# EAGLE schematic 20170814_DukeExperimentalHeadstageAmplifier (EAGLE 8.2.2)
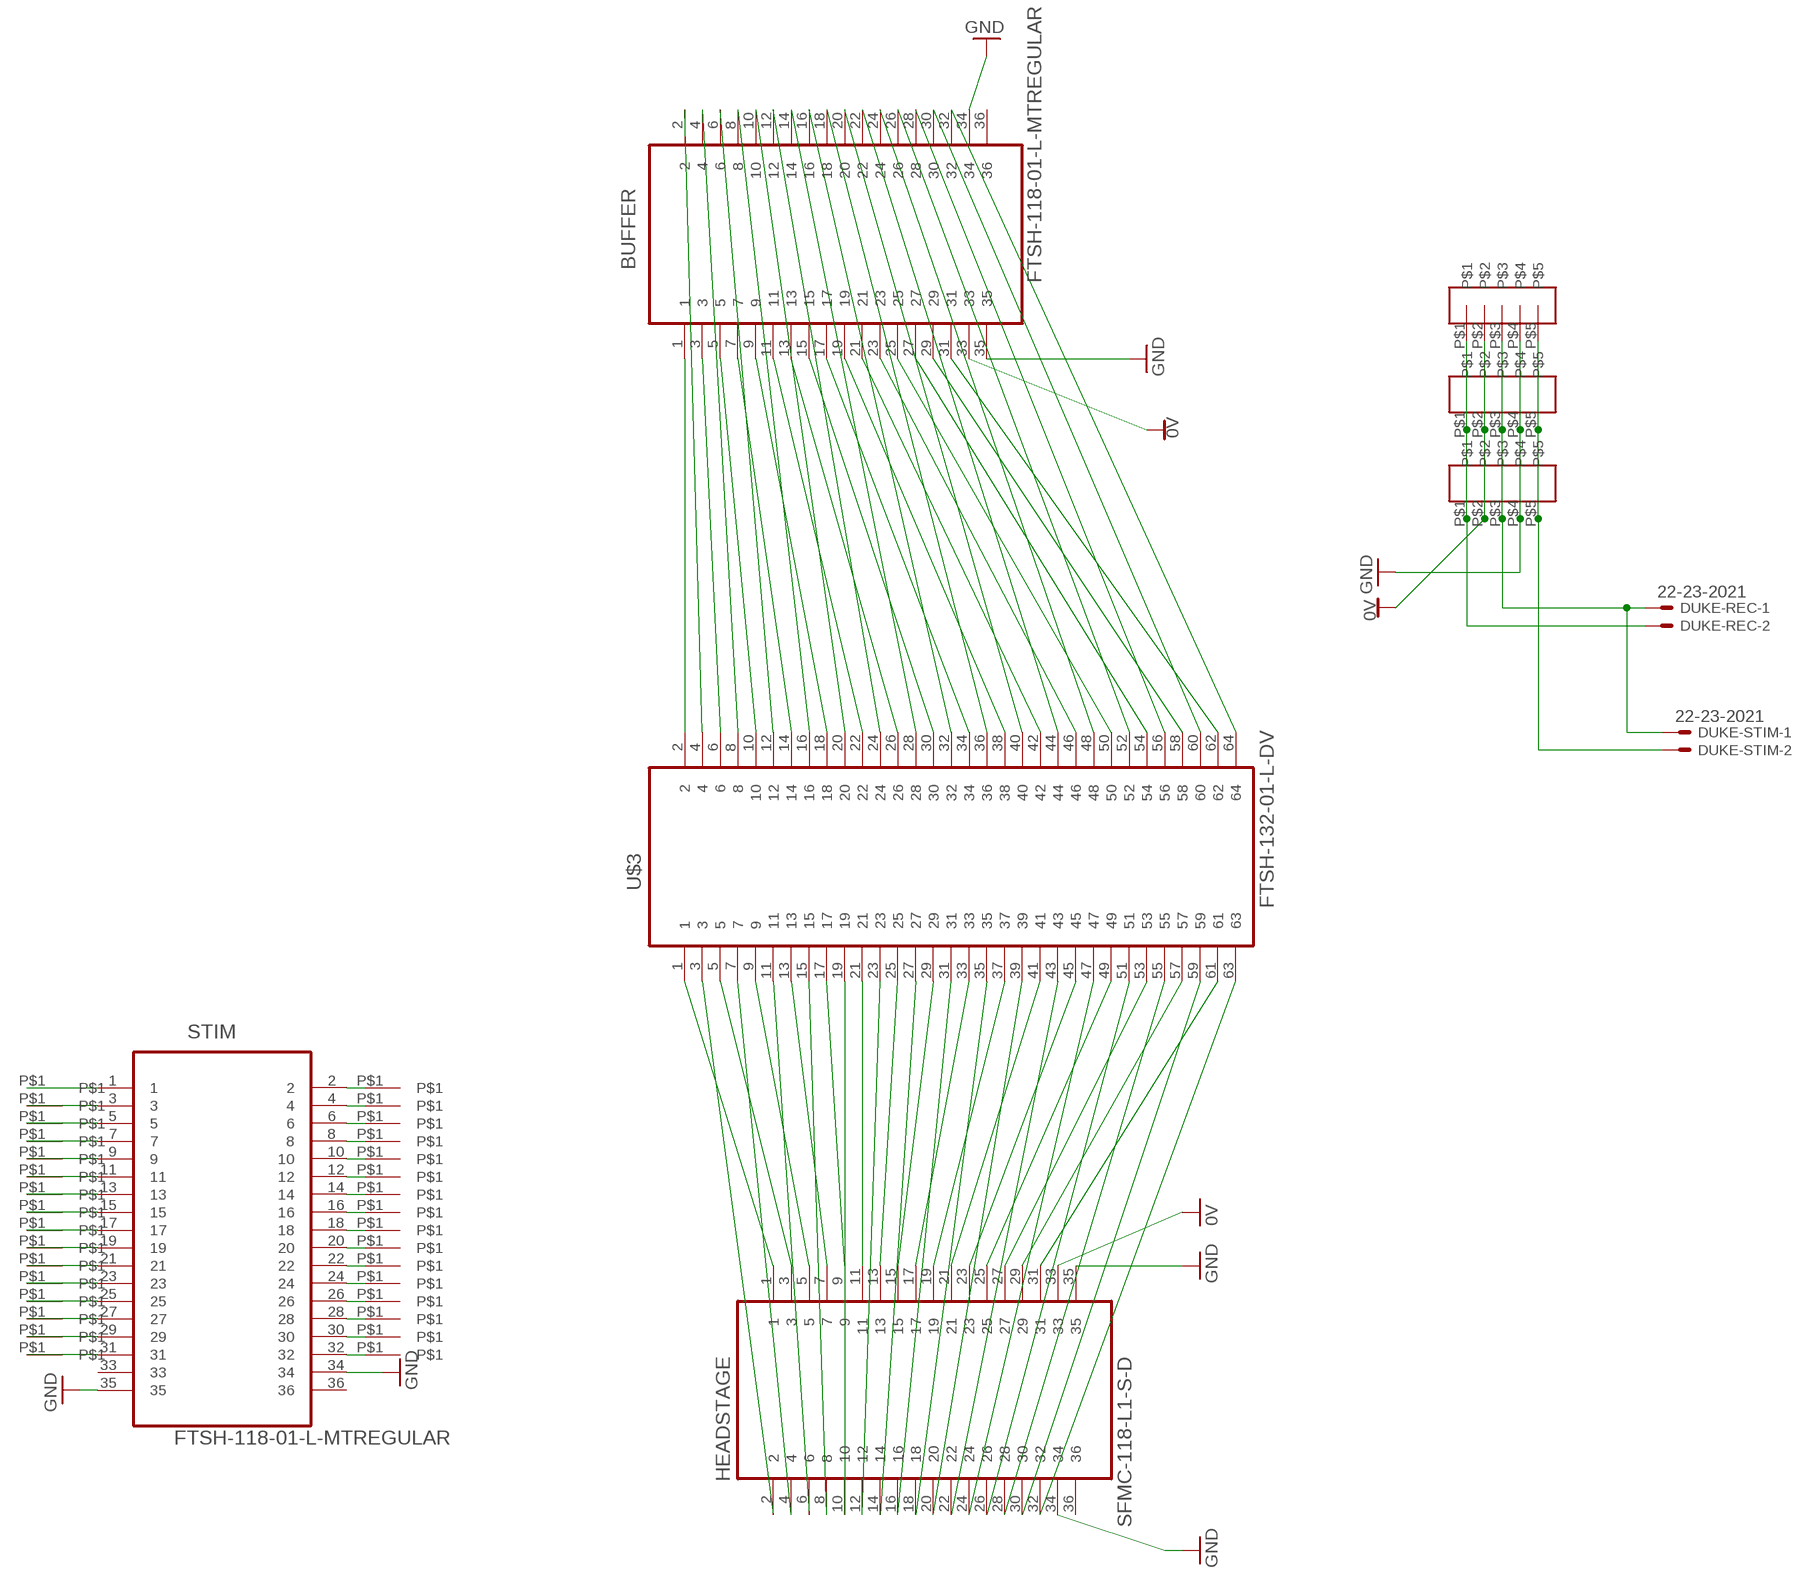
[diagram p0: schematic, sheet 1]

## Parts
BUFFER  FTSH-118-01-L-MTREGULAR  [FTSH-118-01-L-MT]
DUKE-REC  22-23-2021  [22-23-2021]
DUKE-STIM  22-23-2021  [22-23-2021]
HEADSTAGE  SFMC-118-L1-S-D  [SFMC-118-L1-S-D]
STIM  FTSH-118-01-L-MTREGULAR  [FTSH-118-01-L-MT]
U$1  VIA  [VIA]
U$2  VIA  [VIA]
U$3  FTSH-132-01-L-DV  [FTSH-132-01-DV]
U$4  VIA  [VIA]
U$5  VIA  [VIA]
U$6  VIA  [VIA]
U$7  VIA  [VIA]
U$8  VIA  [VIA]
U$9  VIA  [VIA]
U$10  VIA  [VIA]
U$11  VIA  [VIA]
U$12  VIA  [VIA]
U$13  VIA  [VIA]
U$14  VIA  [VIA]
U$15  VIA  [VIA]
U$16  VIA  [VIA]
U$17  VIA  [VIA]
U$18  VIA  [VIA]
U$19  VIA  [VIA]
U$20  VIA  [VIA]
U$21  VIA  [VIA]
U$22  VIA  [VIA]
U$23  VIA  [VIA]
U$24  VIA  [VIA]
U$25  VIA  [VIA]
U$26  VIA  [VIA]
U$27  VIA  [VIA]
U$28  VIA  [VIA]
U$29  VIA  [VIA]
U$30  VIA  [VIA]
U$31  VIA  [VIA]
U$32  VIA  [VIA]
U$33  VIA  [VIA]
U$34  LPPB051NFFN-RC  [LPPB051NFFN-RC]
U$35  LPPB051NFFN-RC  [LPPB051NFFN-RC]
U$36  LPPB051NFFN-RC  [LPPB051NFFN-RC]

## Nets
0V: BUFFER.33 HEADSTAGE.33 U$34.P$2 U$35.P$2 U$36.P$2
GND: BUFFER.34 BUFFER.35 HEADSTAGE.34 HEADSTAGE.35 STIM.34 STIM.35 U$34.P$4 U$35.P$4 U$36.P$4
N$1: BUFFER.1 U$3.2
N$2: BUFFER.29 U$3.58
N$3: BUFFER.3 U$3.6
N$4: BUFFER.2 U$3.4
N$5: BUFFER.5 U$3.10
N$6: BUFFER.7 U$3.14
N$7: BUFFER.9 U$3.18
N$8: BUFFER.11 U$3.22
N$9: BUFFER.13 U$3.26
N$10: BUFFER.15 U$3.30
N$11: BUFFER.17 U$3.34
N$12: BUFFER.19 U$3.38
N$13: BUFFER.27 U$3.54
N$14: BUFFER.23 U$3.46
N$15: BUFFER.25 U$3.50
N$16: BUFFER.4 U$3.8
N$17: BUFFER.6 U$3.12
N$18: BUFFER.31 U$3.62
N$19: BUFFER.8 U$3.16
N$20: BUFFER.10 U$3.20
N$21: BUFFER.12 U$3.24
N$22: BUFFER.14 U$3.28
N$23: BUFFER.16 U$3.32
N$24: BUFFER.18 U$3.36
N$25: BUFFER.20 U$3.40
N$26: BUFFER.21 U$3.42
N$27: BUFFER.22 U$3.44
N$28: BUFFER.24 U$3.48
N$29: BUFFER.26 U$3.52
N$30: BUFFER.28 U$3.56
N$31: BUFFER.30 U$3.60
N$32: BUFFER.32 U$3.64
N$33: HEADSTAGE.1 U$3.1
N$34: HEADSTAGE.3 U$3.5
N$35: HEADSTAGE.5 U$3.9
N$36: HEADSTAGE.7 U$3.13
N$37: HEADSTAGE.9 U$3.17
N$38: HEADSTAGE.11 U$3.21
N$39: HEADSTAGE.13 U$3.25
N$40: HEADSTAGE.15 U$3.29
N$41: HEADSTAGE.17 U$3.33
N$42: HEADSTAGE.19 U$3.37
N$43: HEADSTAGE.21 U$3.41
N$44: HEADSTAGE.23 U$3.45
N$45: HEADSTAGE.25 U$3.49
N$46: HEADSTAGE.27 U$3.53
N$47: HEADSTAGE.29 U$3.57
N$48: HEADSTAGE.31 U$3.61
N$49: HEADSTAGE.2 U$3.3
N$50: HEADSTAGE.4 U$3.7
N$51: HEADSTAGE.6 U$3.11
N$52: HEADSTAGE.8 U$3.15
N$53: HEADSTAGE.10 U$3.19
N$54: HEADSTAGE.12 U$3.23
N$55: HEADSTAGE.14 U$3.27
N$56: HEADSTAGE.16 U$3.31
N$57: HEADSTAGE.18 U$3.35
N$58: HEADSTAGE.20 U$3.39
N$59: HEADSTAGE.22 U$3.43
N$60: HEADSTAGE.24 U$3.47
N$61: HEADSTAGE.26 U$3.51
N$62: HEADSTAGE.28 U$3.55
N$63: HEADSTAGE.30 U$3.59
N$64: HEADSTAGE.32 U$3.63
N$65: STIM.1 U$33.P$1
N$66: STIM.3 U$32.P$1
N$67: STIM.5 U$31.P$1
N$68: STIM.7 U$30.P$1
N$69: STIM.9 U$29.P$1
N$70: STIM.11 U$28.P$1
N$71: STIM.13 U$27.P$1
N$72: STIM.15 U$26.P$1
N$73: STIM.17 U$25.P$1
N$74: STIM.19 U$24.P$1
N$75: STIM.21 U$23.P$1
N$76: STIM.23 U$22.P$1
N$77: STIM.25 U$21.P$1
N$78: STIM.27 U$20.P$1
N$79: STIM.29 U$19.P$1
N$80: STIM.31 U$18.P$1
N$81: STIM.32 U$17.P$1
N$82: STIM.30 U$16.P$1
N$83: STIM.28 U$15.P$1
N$84: STIM.26 U$14.P$1
N$85: STIM.24 U$13.P$1
N$86: STIM.22 U$12.P$1
N$87: STIM.20 U$11.P$1
N$88: STIM.18 U$10.P$1
N$89: STIM.16 U$9.P$1
N$90: STIM.14 U$8.P$1
N$91: STIM.12 U$7.P$1
N$92: STIM.10 U$6.P$1
N$93: STIM.8 U$5.P$1
N$94: STIM.6 U$4.P$1
N$95: STIM.4 U$2.P$1
N$96: STIM.2 U$1.P$1
N$97: DUKE-REC.1 DUKE-STIM.1 U$34.P$3 U$35.P$3 U$36.P$3
N$98: DUKE-REC.2 U$34.P$1 U$35.P$1 U$36.P$1
N$99: DUKE-STIM.2 U$34.P$5 U$35.P$5 U$36.P$5
Unconnected: BUFFER.36 HEADSTAGE.36 STIM.33 STIM.36

## Library data of the parts
BUFFER STIM = tuckerLib2:FTSH-118-01-L-MT
DUKE-REC DUKE-STIM = con-molex:22-23-2021: .100" (2.54mm) Center Header - 2 Pin; MF: MOLEX; MPN: 22-23-2021; OC_FARNELL: 1462926; OC_NEWARK: 25C3832
HEADSTAGE = tuckerLib2:SFMC-118-L1-S-D
U$1 U$2 U$4-U$33 = Sombeck_lib:VIA
U$3 = tuckerLib2:FTSH-132-01-L-DV
U$34-U$36 = Sombeck_lib:LPPB051NFFN-RC